# Altium schematic sheet Digital Outputs.SchDoc: Ravage - Digital Outputs
size A4; Address1: Drawn By:; Address2: Dan Visser; DocumentNumber: A; Revision: 0.1
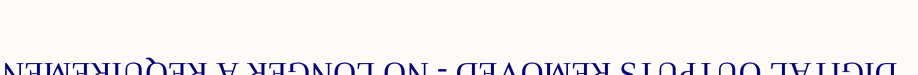
[diagram p0: Digital Outputs.SchDoc]

## Notes on the sheet
- DIGITAL OUTPUTS REMOVED - NO LONGER A REQUIREMENT!
- Title
- Size:
- Date:
- A4
- Number:
- Time:
- Revision:
- Sheet
- of
- File: